# EAGLE design Haptic Sleeve Schematic Copy2 (EAGLE 9.6.2)
DESIGNER: Grant Stankaitis
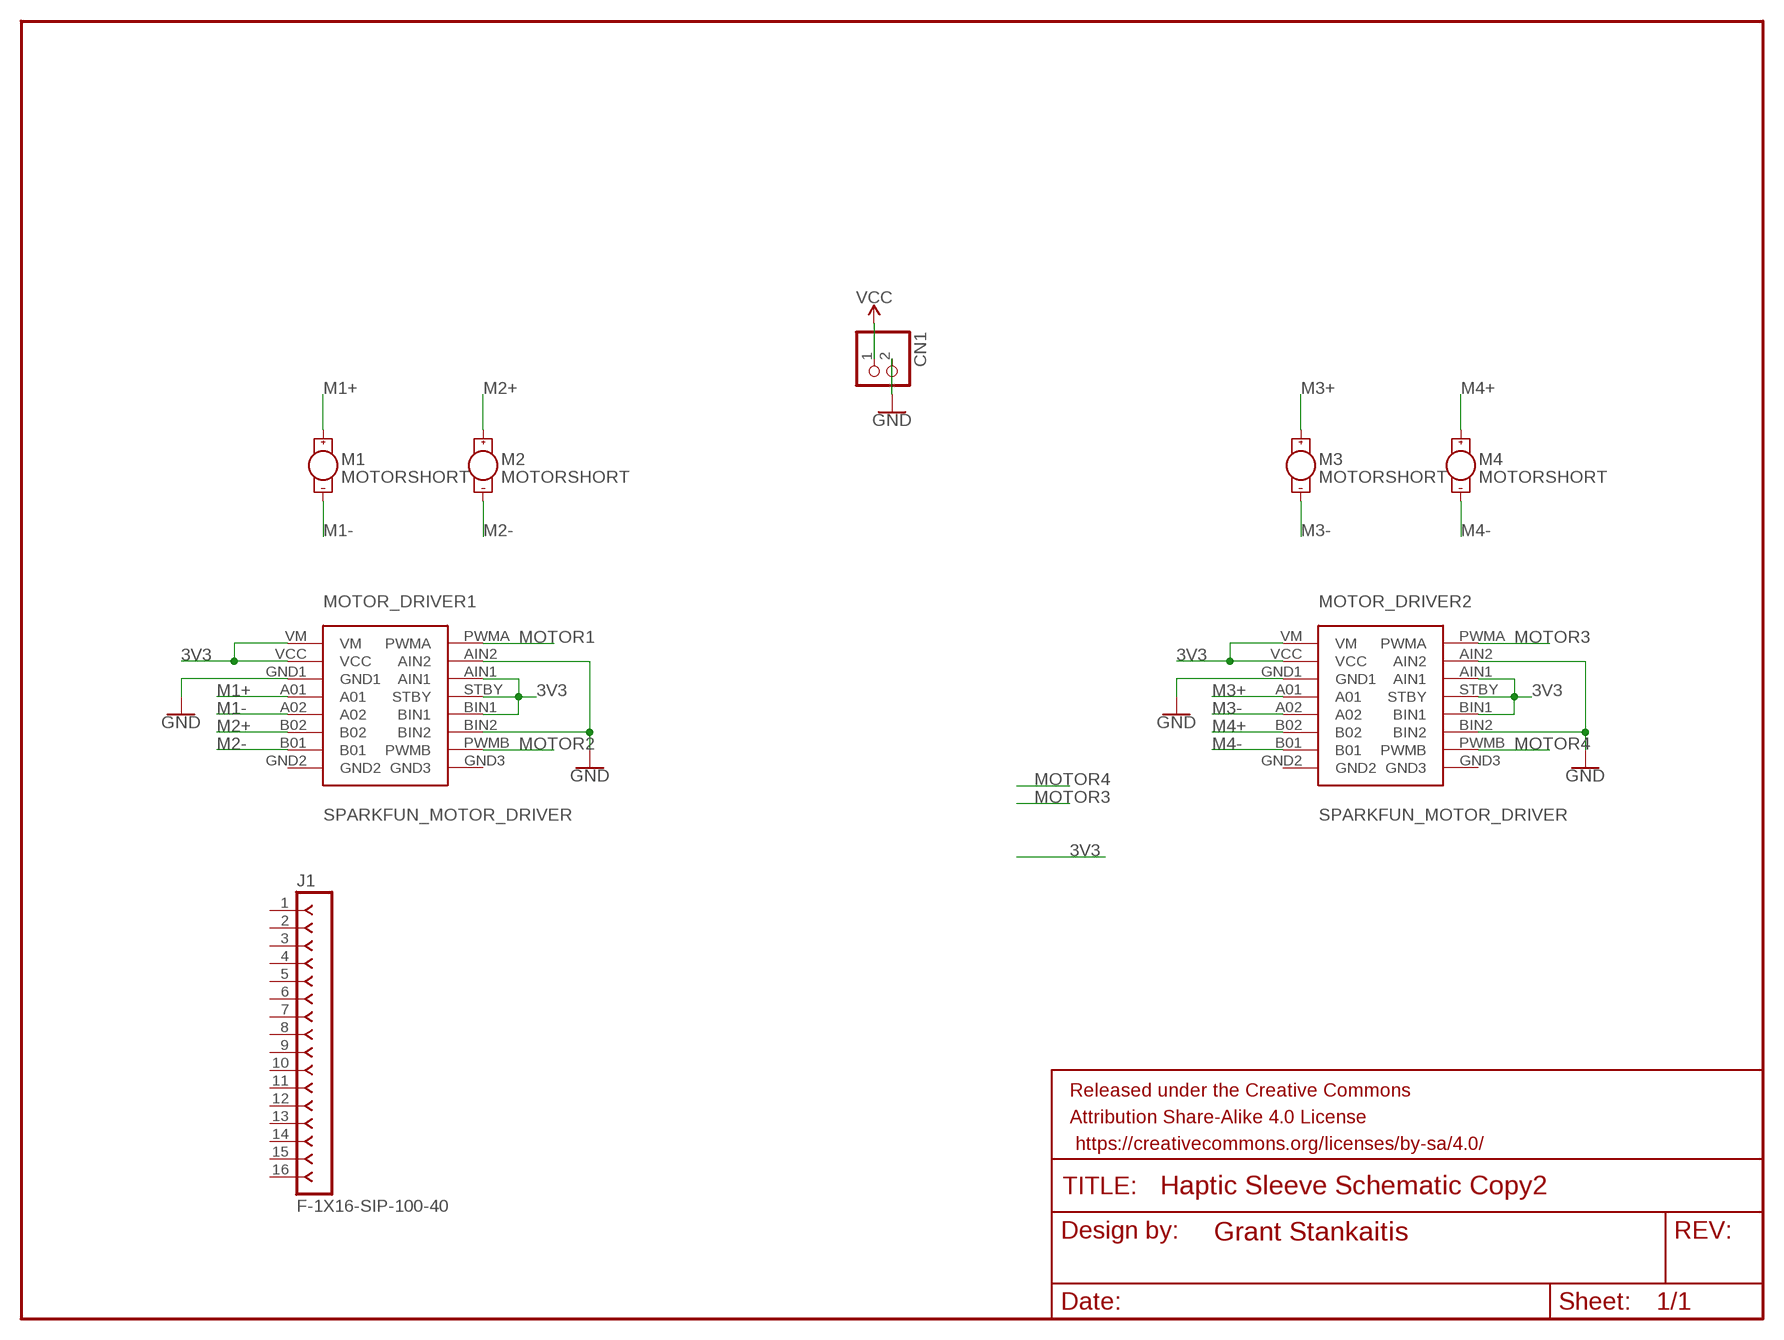
[diagram p0: schematic, sheet 1]

## Parts
CN1  JST_2PIN-THM-RA  [JST-PH-2-THM-RA]
FRAME1  FRAME-LETTERNO_PACKAGE  [DUMMY]
J1  F-1X16-SIP-100-40  [SIP-100-16-40]
M1  MOTORSHORT  [VIBE-MOTOR-10MM-SMD]
M2  MOTORSHORT  [VIBE-MOTOR-10MM-SMD]
M3  MOTORSHORT  [VIBE-MOTOR-10MM-SMD]
M4  MOTORSHORT  [VIBE-MOTOR-10MM-SMD]
MOTOR_DRIVER1  SPARKFUN_MOTOR_DRIVER  [SPARKFUN_MOTOR_DRIVER]
MOTOR_DRIVER2  SPARKFUN_MOTOR_DRIVER  [SPARKFUN_MOTOR_DRIVER]

## Nets
3V3: MOTOR_DRIVER1.AIN1 MOTOR_DRIVER1.BIN1 MOTOR_DRIVER1.STBY MOTOR_DRIVER1.VCC MOTOR_DRIVER1.VM MOTOR_DRIVER2.AIN1 MOTOR_DRIVER2.BIN1 MOTOR_DRIVER2.STBY MOTOR_DRIVER2.VCC MOTOR_DRIVER2.VM
GND: CN1.2 MOTOR_DRIVER1.AIN2 MOTOR_DRIVER1.BIN2 MOTOR_DRIVER1.GND1 MOTOR_DRIVER2.AIN2 MOTOR_DRIVER2.BIN2 MOTOR_DRIVER2.GND1
M1+: M1.+ MOTOR_DRIVER1.A01
M1-: M1.- MOTOR_DRIVER1.A02
M2+: M2.+ MOTOR_DRIVER1.B02
M2-: M2.- MOTOR_DRIVER1.B01
M3+: M3.+ MOTOR_DRIVER2.A01
M3-: M3.- MOTOR_DRIVER2.A02
M4+: M4.+ MOTOR_DRIVER2.B02
M4-: M4.- MOTOR_DRIVER2.B01
MOTOR1: MOTOR_DRIVER1.PWMA
MOTOR2: MOTOR_DRIVER1.PWMB
MOTOR3: MOTOR_DRIVER2.PWMA
MOTOR4: MOTOR_DRIVER2.PWMB
VCC: CN1.1
Unconnected: J1.1 J1.2 J1.3 J1.4 J1.5 J1.6 J1.7 J1.8 J1.9 J1.10 J1.11 J1.12 J1.13 J1.14 J1.15 J1.16 MOTOR_DRIVER1.GND2 MOTOR_DRIVER1.GND3 MOTOR_DRIVER2.GND2 MOTOR_DRIVER2.GND3

## Library data of the parts
CN1 = adafruit:JST_2PIN: JST 2-Pin Connectors of various flavors SMT-RA (S2B-PH-SM4) 4UConnector #17311 SMT (B2B-PH-SM4) THM-RA (S2B-PH) THM (B2B-PH)
FRAME1 = SparkFun-Aesthetics:FRAME-LETTER: Schematic Frame - Letter Standard 8.5x11 US Letter frame; DESIGNER: Grant Stankaitis; VERSION: v01
J1 = con-headers-jp-1:F-1X16-: FEMALE HEADER
M1-M4 = SparkFun-MotorDriver:MOTOR: Motor (Single-Phase) Two-terminal, single-phase motors. SparkFun Products Vibration Motor <https://www.sparkfun.com/products/8449> (ROB-08449) Physical dimension and wire connections for this powerful vibration motor. Motor has a self adhesive backing.; PROD_ID: COMP-13709
MOTOR_DRIVER1 MOTOR_DRIVER2 = SparkFun-MotorDriver:SPARKFUN_MOTOR_DRIVER

## Board
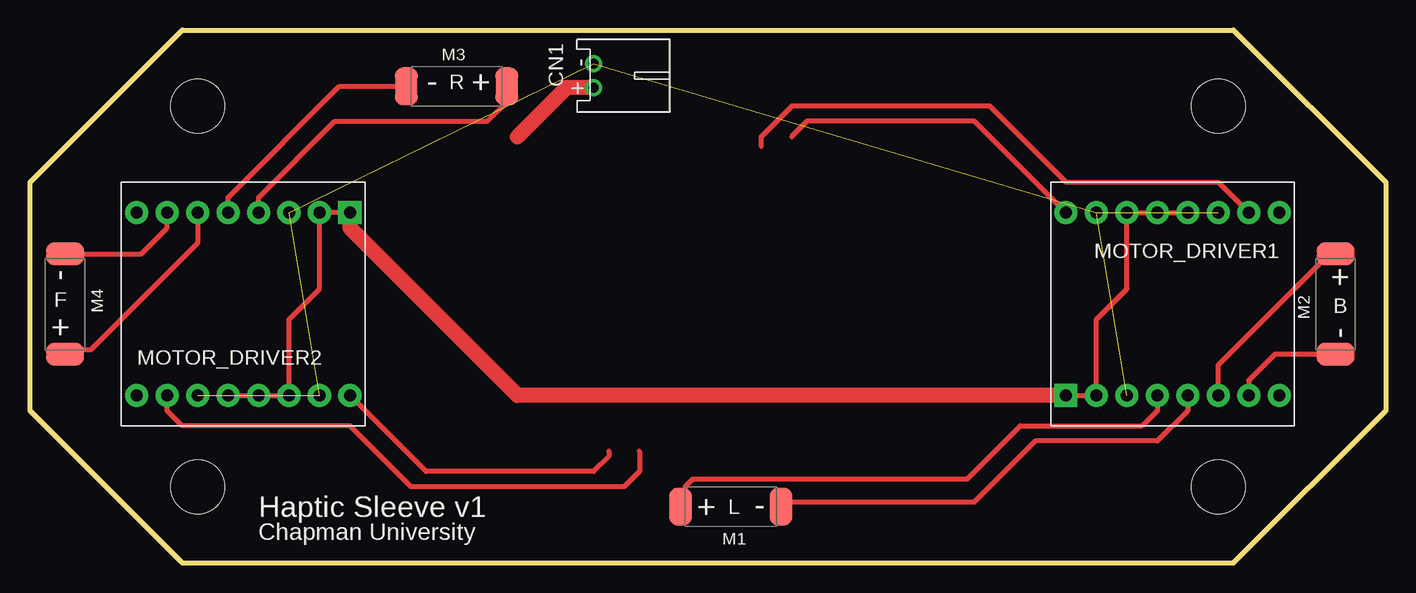
[diagram p1: board, top side]
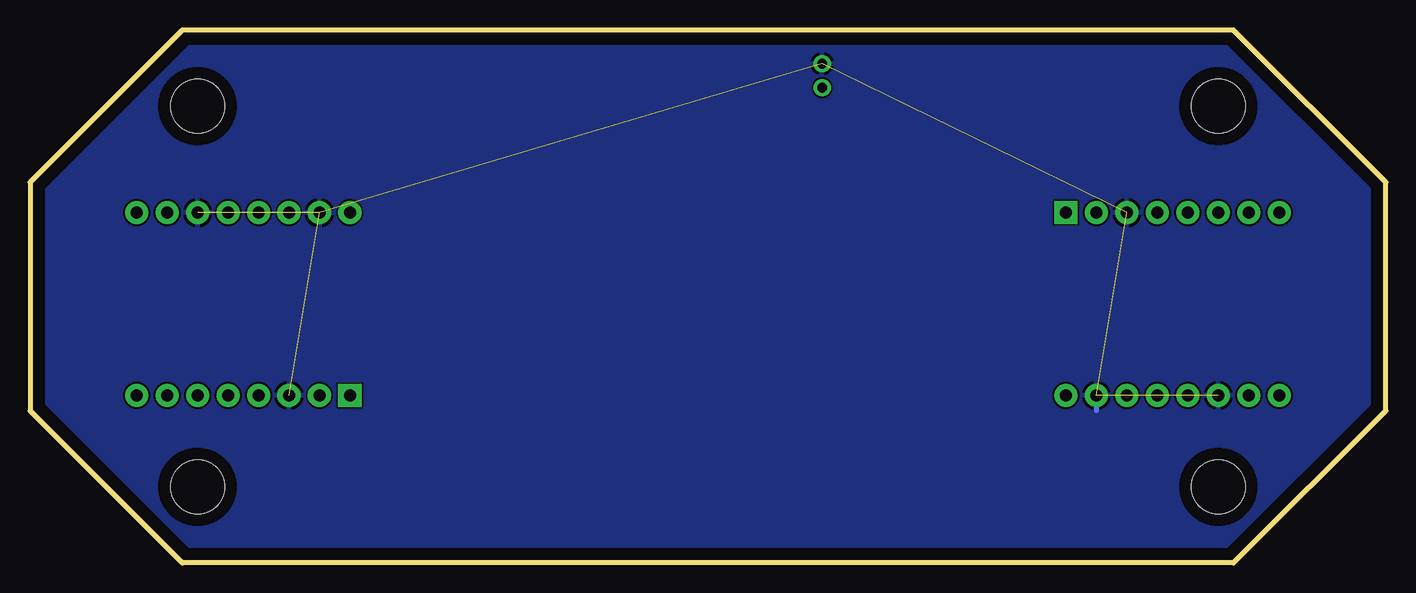
[diagram p2: board, bottom side, seen from below]

Size 113.03 x 44.45 mm. Coordinates in mm from the lower left corner, seen from the top.
Outline: 12.7,44.45 100.33,44.45 113.03,31.75 113.03,12.7 100.33,0 12.7,0 0,12.7 0,31.75 12.7,44.45
Copper layers (1*16): Top 0.035mm / dielectric 1.5mm / Bottom 0.035mm
Design rules "default": minimum track width 6mil, minimum drill 0.35mm, track to track 6mil, track to pad 6mil, pad to pad 6mil, via to via 6mil, smd to smd 6mil, copper to edge 40mil, drill to drill 6mil, minimum pad ring 10mil, minimum via ring 8mil, stop-mask expansion 4mil, vias tented up to drill 0mil, thermal gap 10mil
Holes 4.5 mm at 13.97,38.1 99.06,38.1 13.97,6.35 99.06,6.35

### Footprints (pad centres in the part's own frame; a part is rotated, then mirrored left to right if it is on the bottom)
JST-PH-2-THM-RA = drill 0.8 pad 1.422: 1 1,0; 2 -1,0
SIP-100-16-40 = drill 1.016 pad 1.778 square: 1 -19.05,0 | drill 1.016 pad 1.778 octagon: 2 -16.51,0; 3 -13.97,0; 4 -11.43,0; 5 -8.89,0; 6 -6.35,0; 7 -3.81,0; 8 -1.27,0; 9 1.27,0; 10 3.81,0; 11 6.35,0; 12 8.89,0; 13 11.43,0; 14 13.97,0; 15 16.51,0; 16 19.05,0
VIBE-MOTOR-10MM-SMD = smd 1.905 x 3.175: + 8.001,1.651; - -0.381,1.651
SPARKFUN_MOTOR_DRIVER = drill 1 pad 1.93: A01 0,10.16; A02 0,7.62; AIN1 15.24,12.7; AIN2 15.24,15.24; B01 0,2.54; B02 0,5.08; BIN1 15.24,7.62; BIN2 15.24,5.08; GND1 0,12.7; GND2 0,0; GND3 15.24,0; PWMA 15.24,17.78; PWMB 15.24,2.54; STBY 15.24,10.16; VCC 0,15.24 | drill 1 pad 1.93 square: VM 0,17.78

### Placement (x,y rotation side)
CN1  46.99,40.64 270 top
FRAME1  0,-1.27 0 top
J1  -6.35,-26.67 0 top  (outside the outline)
M1  62.23,6.35 180 top
M2  110.49,17.78 90 top
M3  31.75,38.1 0 top
M4  1.27,25.4 270 top
MOTOR_DRIVER1  104.14,13.97 90 top
MOTOR_DRIVER2  8.89,29.21 270 top

### Tracks (layer width: path | path; a pad name or v marks a point on that pad's centre or on a via)
3V3
  Top 0.406: MOTOR_DRIVER2.VM MOTOR_DRIVER2.VCC 24.13,22.86 21.59,20.32 MOTOR_DRIVER2.AIN1 MOTOR_DRIVER2.STBY MOTOR_DRIVER2.BIN1 | MOTOR_DRIVER1.VM MOTOR_DRIVER1.VCC 88.9,20.32 91.44,22.86 MOTOR_DRIVER1.AIN1 MOTOR_DRIVER1.STBY MOTOR_DRIVER1.BIN1
  Top 1.27: MOTOR_DRIVER1.VM 40.64,13.97 40.63,13.96 40.63,13.98 26.67,27.94 MOTOR_DRIVER2.VM
GND  (6 unrouted)
  Bottom 0.406: MOTOR_DRIVER2.AIN2 24.13,12.7
  pour Bottom: 12.7,44.45 0,31.75 0,12.7 12.7,0 100.33,0 113.03,12.7 113.03,31.75 100.33,44.45
  pour Bottom: 12.7,44.45 0,31.75 0,12.7 12.7,0 100.33,0 113.03,12.7 113.03,31.75 100.33,44.45
M1+
  Top 0.406: M1.+ 54.61,4.32 54.61,6.35 55.24,6.98 78.1,6.98 82.55,11.43 92.71,11.43 93.98,12.7 MOTOR_DRIVER1.A01
M1-
  Top 0.406: MOTOR_DRIVER1.A02 96.52,12.7 93.98,10.16 83.82,10.16 78.74,5.08 62.99,5.08 M1.-
M2+
  Top 0.406: MOTOR_DRIVER1.B02 99.06,16.51 107.95,25.4 109.22,25.4 M2.+
M2-
  Top 0.406: M2.- 103.76,17.4 101.6,15.24 MOTOR_DRIVER1.B01
M3+
  Top 0.406: MOTOR_DRIVER2.A01 19.05,30.48 25.4,36.83 38.1,36.83 39.75,38.48 M3.+
M3-
  Top 0.406: MOTOR_DRIVER2.A02 16.51,30.48 25.78,39.75 M3.-
M4+
  Top 0.406: MOTOR_DRIVER2.B02 13.97,26.67 5.08,17.78 3.3,17.78 M4.+
M4-
  Top 0.406: M4.- 9.27,25.78 11.43,27.94 MOTOR_DRIVER2.B01
MOTOR1
  Top 0.406: MOTOR_DRIVER1.PWMA 78.74,36.83 64.77,36.83 63.49,35.55
MOTOR2
  Top 0.406: MOTOR_DRIVER1.PWMB 99.06,31.75 86.36,31.75 80.01,38.1 63.5,38.1 60.96,35.56 60.96,34.73
MOTOR3
  Top 0.406: MOTOR_DRIVER2.PWMA 33.02,7.62 46.99,7.62 48.26,8.89 48.26,9.31
MOTOR4
  Top 0.406: 50.8,9.31 50.8,7.62 49.53,6.35 31.75,6.35 26.67,11.43 17.78,11.43 16.51,11.43 12.7,11.43 11.43,12.7 MOTOR_DRIVER2.PWMB
VCC
  Top 1.27: CN1.1 44.72,39.64 40.63,35.55

### Text on the board
tPlace: + | - | R | - | + | F | B | + | - | - | + | L | Haptic Sleeve v1 | Chapman University